# EAGLE design wm_backuper (EAGLE 5.11)
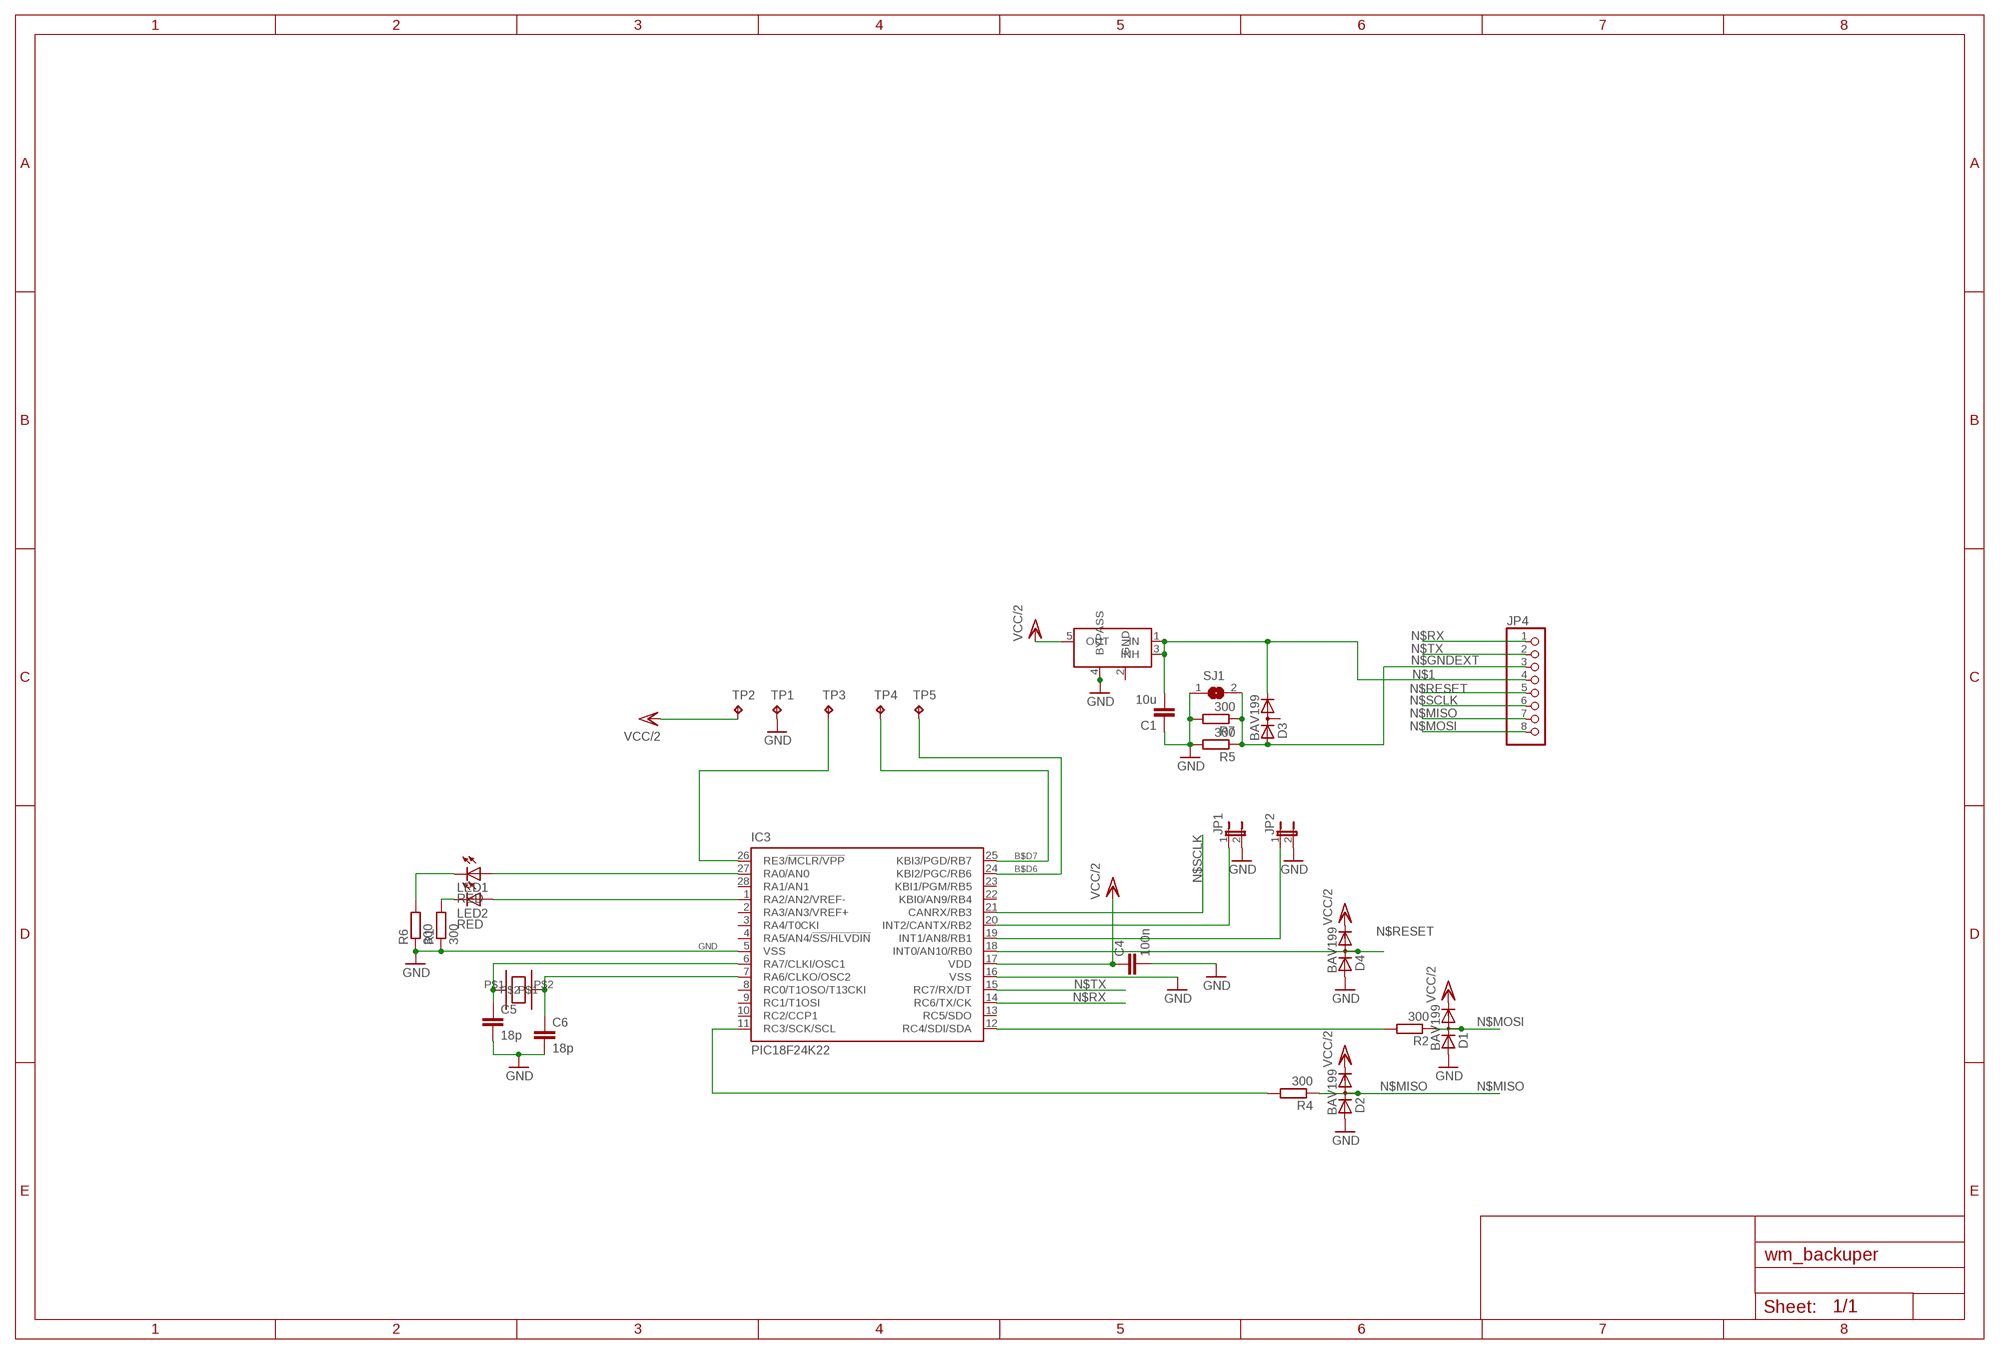
[diagram p0: schematic, sheet 1]

## Parts
C1  10u  C-EUC0603K  [C0603K]
C4  100n  C-EUC0603K  [C0603K]
C5  18p  C-EUC0603K  [C0603K]
C6  18p  C-EUC0603K  [C0603K]
D1  BAV199  [SOT23]
D2  BAV199  [SOT23]
D3  BAV199  [SOT23]
D4  BAV199  [SOT23]
IC3  PIC18F24K22  PIC18F2580-I/ML  [QFN28-ML_6X6MM]
JP1  JP1E  [JP1]
JP2  JP1E  [JP1]
JP4  PINHD-1X8/90  [1X08/90]
LED1  RED  LEDCHIPLED_1206  [CHIPLED_1206]
LED2  RED  LEDCHIPLED_1206  [CHIPLED_1206]
R1  300  R-EU_R0603  [R0603]
R2  300  R-EU_R0603  [R0603]
R4  300  R-EU_R0603  [R0603]
R5  300  R-EU_R0603  [R0603]
R6  300  R-EU_R0603  [R0603]
R7  300  R-EU_R0603  [R0603]
SJ1  SJ  [SJ]
TP1  TPTP12SQ  [TP12SQ]
TP2  TPTP12SQ  [TP12SQ]
TP3  TPTP12SQ  [TP12SQ]
TP4  TPTP12SQ  [TP12SQ]
TP5  TPTP12SQ  [TP12SQ]
U$1  Q_5032  [FT5032]
U$2  LD3985  [SOT23-5L]

## Nets
B$D6: IC3.24(KBI2/PGC/RB6) TP5.TP
B$D7: IC3.25(KBI3/PGD/RB7) TP4.TP
GND: C1.1 C4.2 C5.2 C6.2 D1.1(A) D2.1(A) D4.1(A) IC3.5(VSS) IC3.16(VSS) JP1.2 JP2.2 R1.1 R5.2 R6.1 R7.2 SJ1.1 TP1.TP U$2.4(BYPASS)
MCLR: IC3.26(RE3/!MCLR/VPP) TP3.TP
N$1: C1.2 D3.2(C) JP4.4 U$2.1(IN) U$2.3(INH)
N$4: IC3.27(RA0/AN0) LED1.A
N$5: LED1.C R6.2
N$6: C5.1 IC3.6(RA7/CLKI/OSC1) U$1.P$1
N$7: IC3.20(INT2/CANTX/RB2) JP1.1
N$8: C6.1 IC3.7(RA6/CLKO/OSC2) U$1.P$2
N$9: IC3.19(INT1/AN8/RB1) JP2.1
N$10: IC3.1(RA2/AN2/VREF-) LED2.A
N$11: LED2.C R1.2
N$18: IC3.12(RC4/SDI/SDA) R2.2
N$19: IC3.11(RC3/SCK/SCL) R4.2
N$GNDEXT: D3.1(A) JP4.3 R5.1 R7.1 SJ1.2
N$MISO: D2.3(AC) JP4.7 R4.1
N$MOSI: D1.3(AC) JP4.8 R2.1
N$RESET: D4.3(AC) IC3.18(INT0/AN10/RB0) JP4.5
N$RX: IC3.14(RC6/TX/CK) JP4.1
N$SCLK: IC3.21(CANRX/RB3) JP4.6
N$TX: IC3.15(RC7/RX/DT) JP4.2
VCC/2: C4.1 D1.2(C) D2.2(C) D4.2(C) IC3.17(VDD) TP2.TP U$2.5(OUT)
Unconnected: D3.3(AC) IC3.2(RA3/AN3/VREF+) IC3.3(RA4/T0CKI) IC3.4(RA5/AN4/!SS/HLVDIN) IC3.8(RC0/T1OSO/T13CKI) IC3.9(RC1/T1OSI) IC3.10(RC2/CCP1) IC3.13(RC5/SDO) IC3.22(KBI0/AN9/RB4) IC3.23(KBI1/PGM/RB5) IC3.28(RA1/AN1) U$2.2(GND)

## Library data of the parts
C1 C4-C6 = resistor:C-EU: CAPACITOR, European symbol
D1-D4 = diode:BAV199: DIODE low-leakage double diode
IC3 = microchip:PIC18F2*80: 28-Pin Enhanced Flash Microcontrollers with ECAN(TM) Technology 10-Bit A/D and nanoWatt Technology Source: http://www.microchip.com .. 39637a.pdf
JP1 JP2 = jumper:JP1E: JUMPER
JP4 = pinhead:PINHD-1X8: PIN HEADER
LED1 LED2 = led:LED: LED OSRAM: - CHIPLED LG R971, LG N971, LY N971, LG Q971, LY Q971, LO R971, LY R971 LH N974, LH R974 LS Q976, LO Q976, LY Q976 LO Q996 - Hyper CHIPLED LW Q18S LB Q993, LB Q99A, LB R99A - SideLED LS A670, LO A670, LY A670, LG A670, LP A670 LB A673, LV A673, LT A673, LW A673 LH A674 LY A675 LS A676, LA A676, LO A676, LY A676, LW A676 LS A679, LY A679, LG A679 - Hyper Micro SIDELED® LS Y876, LA Y876, LO Y876, LY Y876 LT Y87S - SmartLED LW L88C, LW L88S LB L89C, LB L89S, LG L890 LS L89K, LO L89K, LY L89K LS L896, LA L896, LO L896, LY L896 - TOPLED LS T670, LO T670, LY T670, LG T670, LP T670 LSG T670, LSP T670, LSY T670, LOP T670, LYG T670 LG T671, LOG T671, LSG T671 LB T673, LV T673, LT T673, LW T673 LH T674 LS T676, LA T676, LO T676, LY T676, LB T676, LH T676, LSB T676, LW T676 LB T67C, LV T67C, LT T67C, LS T67K, LO T67K, LY T67K, LW E67C LS E67B, LA E67B, LO E67B, LY E67B, LB E67C, LV E67C, LT E67C LW T67C LS T679, LY T679, LG T679 LS T770, LO T770, LY T770, LG T770, LP T770 LB T773, LV T773, LT T773, LW T773 LH T774 LS E675, LA E675, LY E675, LS T675 LS T776, LA T776, LO T776, LY T776, LB T776 LHGB T686 LT T68C, LB T68C - Hyper Mini TOPLED® LB M676 - Mini TOPLED Santana® LG M470 LS M47K, LO M47K, LY M47K Source: http://www.osram.convergy.de LUXEON: - LUMILED® LXK2-PW12-R00, LXK2-PW12-S00, LXK2-PW14-U00, LXK2-PW14-V00 LXK2-PM12-R00, LXK2-PM12-S00, LXK2-PM14-U00 LXK2-PE12-Q00, LXK2-PE12-R00, LXK2-PE12-S00, LXK2-PE14-T00, LXK2-PE14-U00 LXK2-PB12-K00, LXK2-PB12-L00, LXK2-PB12-M00, LXK2-PB14-N00, LXK2-PB14-P00, LXK2-PB14-Q00 LXK2-PR12-L00, LXK2-PR12-M00, LXK2-PR14-Q00, LXK2-PR14-R00 LXK2-PD12-Q00, LXK2-PD12-R00, LXK2-PD12-S00 LXK2-PH12-R00, LXK2-PH12-S00 LXK2-PL12-P00, LXK2-PL12-Q00, LXK2-PL12-R00 Source: www.luxeon.com KINGBRIGHT: KA-3528ASYC Source: www.kingbright.com
R1 R2 R4-R7 = resistor:R-EU_: RESISTOR, European symbol
SJ1 = jumper:SJ: SMD solder JUMPER
TP1-TP5 = testpad:TP: Test pad
U$1 = MYLIB:Q_5032
U$2 = MYLIB:LD3985

## Board
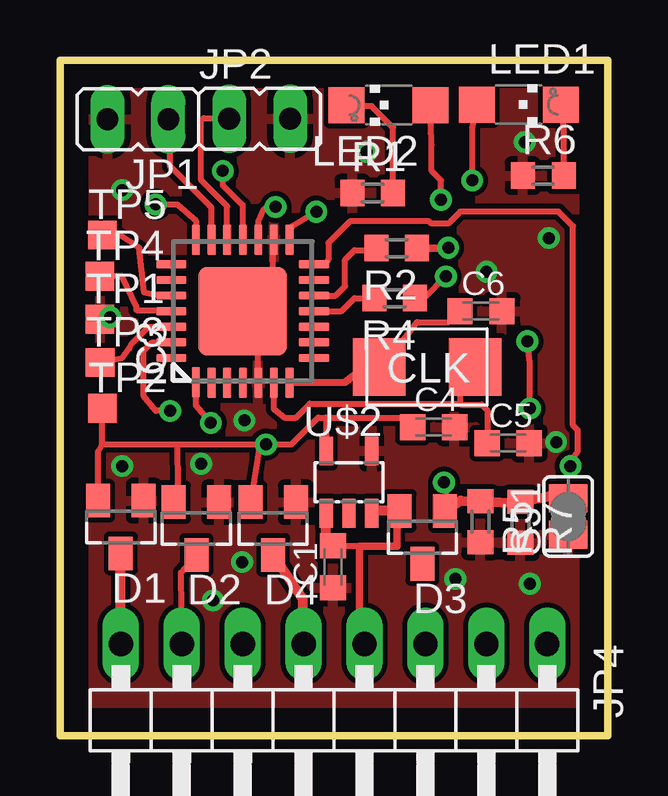
[diagram p1: board, top side]
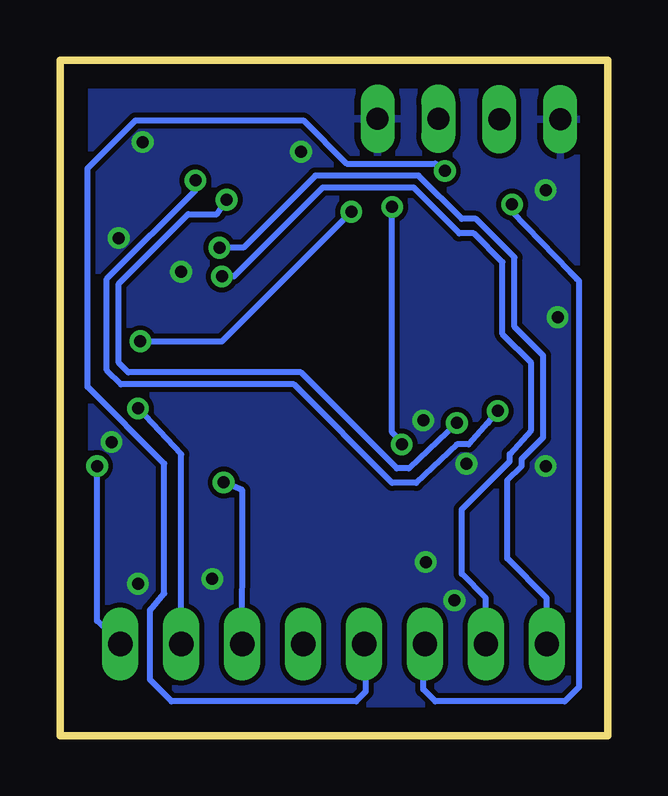
[diagram p2: board, bottom side, seen from below]

Size 22.84 x 28.15 mm. Coordinates in mm from the lower left corner, seen from the top.
Outline: 0,0 22.84,0 22.84,28.15 0,28.15 0,0
Copper layers (1*16): Top 0.035mm / dielectric 1.5mm / Bottom 0.035mm
Design rules "default": minimum track width 10mil, minimum drill 24mil, track to track 8mil, track to pad 8mil, pad to pad 8mil, via to via 8mil, smd to smd 8mil, copper to edge 40mil, drill to drill 8mil, minimum pad ring 10mil, minimum via ring 8mil, stop-mask expansion 4mil, vias tented up to drill 0mil, thermal gap 10mil

### Footprints (pad centres in the part's own frame; a part is rotated, then mirrored left to right if it is on the bottom)
C0603K = smd 1.05 x 1.08: 1 -0.875,0; 2 0.875,0
SOT23 = smd 1 x 1.4: 1 -0.95,-1.1; 2 0.95,-1.1; 3 0,1.1
QFN28-ML_6X6MM = smd 1.27 x 0.35: 1 -2.962,1.95; 2 -2.977,1.3; 3 -2.977,0.65; 4 -2.977,0; 5 -2.977,-0.65; 6 -2.977,-1.3; 7 -2.977,-1.95; 15 2.977,-1.95; 16 2.977,-1.3; 17 2.977,-0.65; 18 2.977,0; 19 2.977,0.65; 20 2.977,1.3; 21 2.977,1.95 | smd 0.35 x 1.27: 8 -1.95,-2.977; 9 -1.3,-2.977; 10 -0.65,-2.977; 11 0,-2.977; 12 0.65,-2.977; 13 1.3,-2.977; 14 1.95,-2.977; 22 1.95,2.977; 23 1.3,2.977; 24 0.65,2.977; 25 0,2.977; 26 -0.65,2.977; 27 -1.3,2.977; 28 -1.95,2.977 | smd 3.7 x 3.7: EXP 0,0
JP1 = drill 0.914 long: 1 0,-1.27; 2 0,1.27
1X08/90 = drill 1.016 long: 1 -8.89,-3.81; 2 -6.35,-3.81; 3 -3.81,-3.81; 4 -1.27,-3.81; 5 1.27,-3.81; 6 3.81,-3.81; 7 6.35,-3.81; 8 8.89,-3.81
CHIPLED_1206 = smd 1.5 x 1.5: A 0,-1.75; C 0,1.75
R0603 = smd 1 x 1.1: 1 -0.85,0; 2 0.85,0
SJ = smd 1.168 x 1.6: 1 -0.762,0; 2 0.762,0
TP12SQ = smd 1.2 x 1.2: TP 0,0
FT5032 = smd 2.2 x 2.4: P$1 -2,0; P$2 2,0
SOT23-5L = smd 0.55 x 1.2: 1 -0.95,-1.3; 2 0,-1.3; 3 0.95,-1.3; 4 0.95,1.3; 5 -0.95,1.3

### Placement (x,y rotation side)
C1  11.39,7.03 90 top
C4  15.58,12.86 0 top
C5  18.69,12.19 0 top
C6  17.55,17.69 0 top
D1  2.54,8.69 180 top
D2  5.69,8.63 180 top
D3  15.11,8.26 180 top
D4  8.89,8.63 180 top
IC3  7.62,17.68 90 top
JP1  3.25,25.68 90 top
JP2  8.33,25.7 270 top
JP4  11.43,0 180 top
LED1  19.13,26.29 270 top
LED2  13.7,26.27 90 top
R1  13.04,22.61 0 top
R2  14.04,20.31 180 top
R4  13.96,18.23 180 top
R5  17.53,8.91 270 top
R6  20.15,23.33 0 top
R7  19.2,8.88 270 top
SJ1  21.19,9.13 90 top
TP1  1.67,17.35 0 top
TP2  1.77,13.64 0 top
TP3  1.68,15.55 0 top
TP4  1.67,19.14 0 top
TP5  1.77,20.86 0 top
U$1  15.31,15.36 180 top
U$2  12.05,10.56 0 top

### Tracks (layer width: path | path; a pad name or v marks a point on that pad's centre or on a via)
B$D6
  Top 0.254: TP5.TP 2.48,20.86 3.31,20.32 3.51,18.48 4.27,18.32 4.9,18.32 IC3.24
B$D7
  Top 0.254: TP4.TP 2.57,19.14 3.19,17.83 3.19,17.73 4.88,17.73 IC3.25
GND  (via drill 0.5)
  Top 0.254: IC3.5 8.27,18.21 8.89,18.83 8.89,20.36 IC3.16
  other vias: 5.89,11.33 7.59,7.23 20.69,12.23 7.69,13.13 17.79,19.33 19.59,6.33 19.39,24.73 12.79,24.33 2.59,22.73 2.59,11.23 20.39,20.73 6.39,5.63 16.49,6.53 2.09,17.43
  pour Bottom: -1.27,30.48 24.13,30.48 24.13,-1.27 -1.27,-1.27
  pour Top: -1.27,30.48 24.13,30.48 24.13,-1.27 -1.27,-1.27
MCLR
  Top 0.254: TP3.TP 2.6,15.75 2.89,16.13 2.99,16.33 3.69,17.03 4.91,17.03 IC3.26
N$1
  Top 0.254: C1.2 12.42,7.91 12.49,7.83
  Top 0.305: 12.49,4.02 12.49,7.83 12.48,7.89 14.06,7.89 14.06,8.57 D3.2
  Top 0.406: 12.49,4.02 JP4.4 | C1.2 11.1,7.91 U$2.1 | D3.2 13,9.36 U$2.3
N$4  (via drill 0.5)
  Top 0.254: IC3.27 3.85,16.39 3.49,16.03 3.49,14.13 3.99,13.53 v4.59,13.53 | v17.19,23.13 17.19,25.3 LED1.A
  Bottom 0.254: v17.19,23.13 17.19,22.73 20.89,19.03 20.89,15.23 20.29,14.63 13.09,14.63 8.99,10.53 7.99,10.53 6.29,12.13 5.79,12.13 4.99,13.03 v4.59,13.53
N$5
  Top 0.254: R6.2 21,25.37 LED1.C
N$6
  Top 0.254: IC3.6 8.92,13.6 9.39,13.23 9.81,13.23 10.42,13.84 16.69,13.84 | 16.69,13.84 16.69,13.81 16.72,13.79 17.59,13.79 17.82,13.55 C5.1 | 16.69,13.84 16.69,15.26
  Top 0.305: 16.69,15.26 U$1.P$1
N$7
  Top 0.254: IC3.20 6.32,22 4.59,23.73 4.59,25.61 JP1.1
N$8
  Top 0.254: U$1.P$2 14.12,15.36 14.09,16.13 14.19,16.33 14.89,17.23 16.21,17.23 C6.1
  Top 0.305: IC3.7 11.89,14.73 12.24,14.98 12.83,14.98 U$1.P$2
N$9
  Top 0.254: IC3.19 6.97,22.05 5.89,23.13 5.89,25.63 5.99,25.73 7.03,25.73 JP2.1
N$10  (via drill 0.5)
  Top 0.254: IC3.1 5.67,13.75 v6.29,13.03 | v15.89,22.33 15.89,23.13 15.49,23.53 15.49,24.63 LED2.A
  Bottom 0.254: v15.89,22.33 16.29,21.73 17.49,21.73 20.39,18.83 20.39,15.53 19.99,15.13 12.79,15.13 8.79,11.13 8.29,11.13 v6.29,13.03
N$11
  Top 0.254: R1.2 13.89,25.33 12.99,26.23 11.99,26.23 LED2.C
N$18
  Top 0.254: IC3.12 11.49,18.34 11.89,18.73 11.89,19.83 12.29,20.23 13.07,20.23
  Top 0.305: 13.07,20.23 R2.2
N$19
  Top 0.254: IC3.11 11.74,17.68 12.29,18.23 R4.2
N$GNDEXT  (via drill 0.5)
  Top 0.254: v16.01,10.55 16.1,10.62 16.1,9.4 D3.1
  Top 0.406: D3.1 16.71,9.79 R5.1 18.79,9.71 R7.1 20.89,10.07 SJ1.2
  Bottom 0.254: JP4.3 15.23,8.48 15.23,10.22 v16.01,10.55
N$MISO  (via drill 0.5)
  Top 0.254: R4.1 15.19,18.23 v16.09,19.13 | D2.3 5.05,6.8 5.08,5.23 JP4.7
  Bottom 0.254: v16.09,19.13 15.59,19.13 11.89,22.83 8.09,22.83 6.19,20.93 5.59,20.93 4.39,19.73 4.39,16.73 3.19,15.53 3.19,12.73 4.09,11.73 4.09,11.43 6.09,9.43 6.09,6.74 5.08,5.73 JP4.7
N$MOSI  (via drill 0.5)
  Top 0.305: R2.1 15.87,20.31 v16.19,20.33
  Top 0.406: JP4.8 D1.3
  Bottom 0.254: JP4.8 2.54,5.73 4.19,7.38 4.19,10.63 3.59,11.23 3.59,11.53 2.69,12.43 2.69,15.83 3.89,17.03 3.89,19.93 5.49,21.53 6.09,21.53 7.89,23.33 12.19,23.33 15.19,20.33 v16.19,20.33
N$RESET  (via drill 0.5)
  Top 0.254: IC3.18 7.62,22.1 6.79,22.93 v6.79,23.53
  Top 0.406: JP4.5 10.13,5.69 D4.3
  Bottom 0.254: JP4.5 10.09,3.74 10.09,1.83 10.49,1.43 18.19,1.43 19.09,2.33 19.09,5.23 18.49,5.93 18.49,11.33 21.69,14.53 21.69,23.63 19.69,25.63 12.69,25.63 10.89,23.83 7.19,23.83 6.79,23.63 v6.79,23.53
N$RX  (via drill 0.5)
  Top 0.254: IC3.14 10.99,19.64 11.19,19.83 11.19,20.53 12.09,21.43 15.39,21.43 15.49,21.33 16.19,21.33 16.69,21.83 20.79,21.83 21.39,21.23 21.39,12.93 21.59,12.73 21.59,11.83 21.39,11.53 21.49,11.43 v21.29,11.23
  Bottom 0.254: v21.29,11.23 21.29,4.78 JP4.1
N$SCLK  (via drill 0.5)
  Top 0.254: IC3.21 5.67,21.45 4.89,22.13 v3.99,22.13
  Bottom 0.254: v3.99,22.13 3.99,21.83 1.57,19.32 | 1.57,19.32 1.29,19.03 | JP4.6 7.69,3.74 7.69,1.93 7.19,1.43 1.79,1.43 1.19,2.03 1.19,18.94 1.57,19.32
N$TX  (via drill 0.5)
  Top 0.254: v10.69,21.83 9.69,21.23 9.59,21.13 9.59,20.41 | v19.59,13.63 19.59,15.53 v19.49,16.43
  Top 0.305: 9.59,20.41 IC3.15
  Bottom 0.254: JP4.2 17.78,11.72 v19.59,13.63 | v19.49,16.43 16.09,16.43 v10.69,21.83
VCC/2  (via drill 0.5)
  Top 0.254: D1.2 1.59,11.83 1.77,12.11 1.77,12.23 | D4.2 8.31,11.95 8.49,12.13 | 1.77,12.23 TP2.TP | 4.89,12.13 1.87,12.13 1.77,12.23 | IC3.17 8.27,21.41 8.49,21.93 v8.99,22.03 | D2.2 4.9,10.42 4.89,12.13 | 4.89,12.13 8.49,12.13 | 8.49,12.13 v8.59,12.13 9.65,12.13 10.77,13.25 11.09,13.25 | 11.09,13.25 14.25,13.25 14.48,13.02 14.67,12.67 C4.1 | U$2.5 11.1,13.24 11.09,13.25
  Bottom 0.254: v8.59,12.13 8.59,12.23 8.99,12.63 v8.99,22.03